# Altium schematic sheet serializer.SchDoc: SERIALIZER
size 431 x 279 mm; SheetNumber: 4; SheetTotal: 4; SheetRevision: 1.0
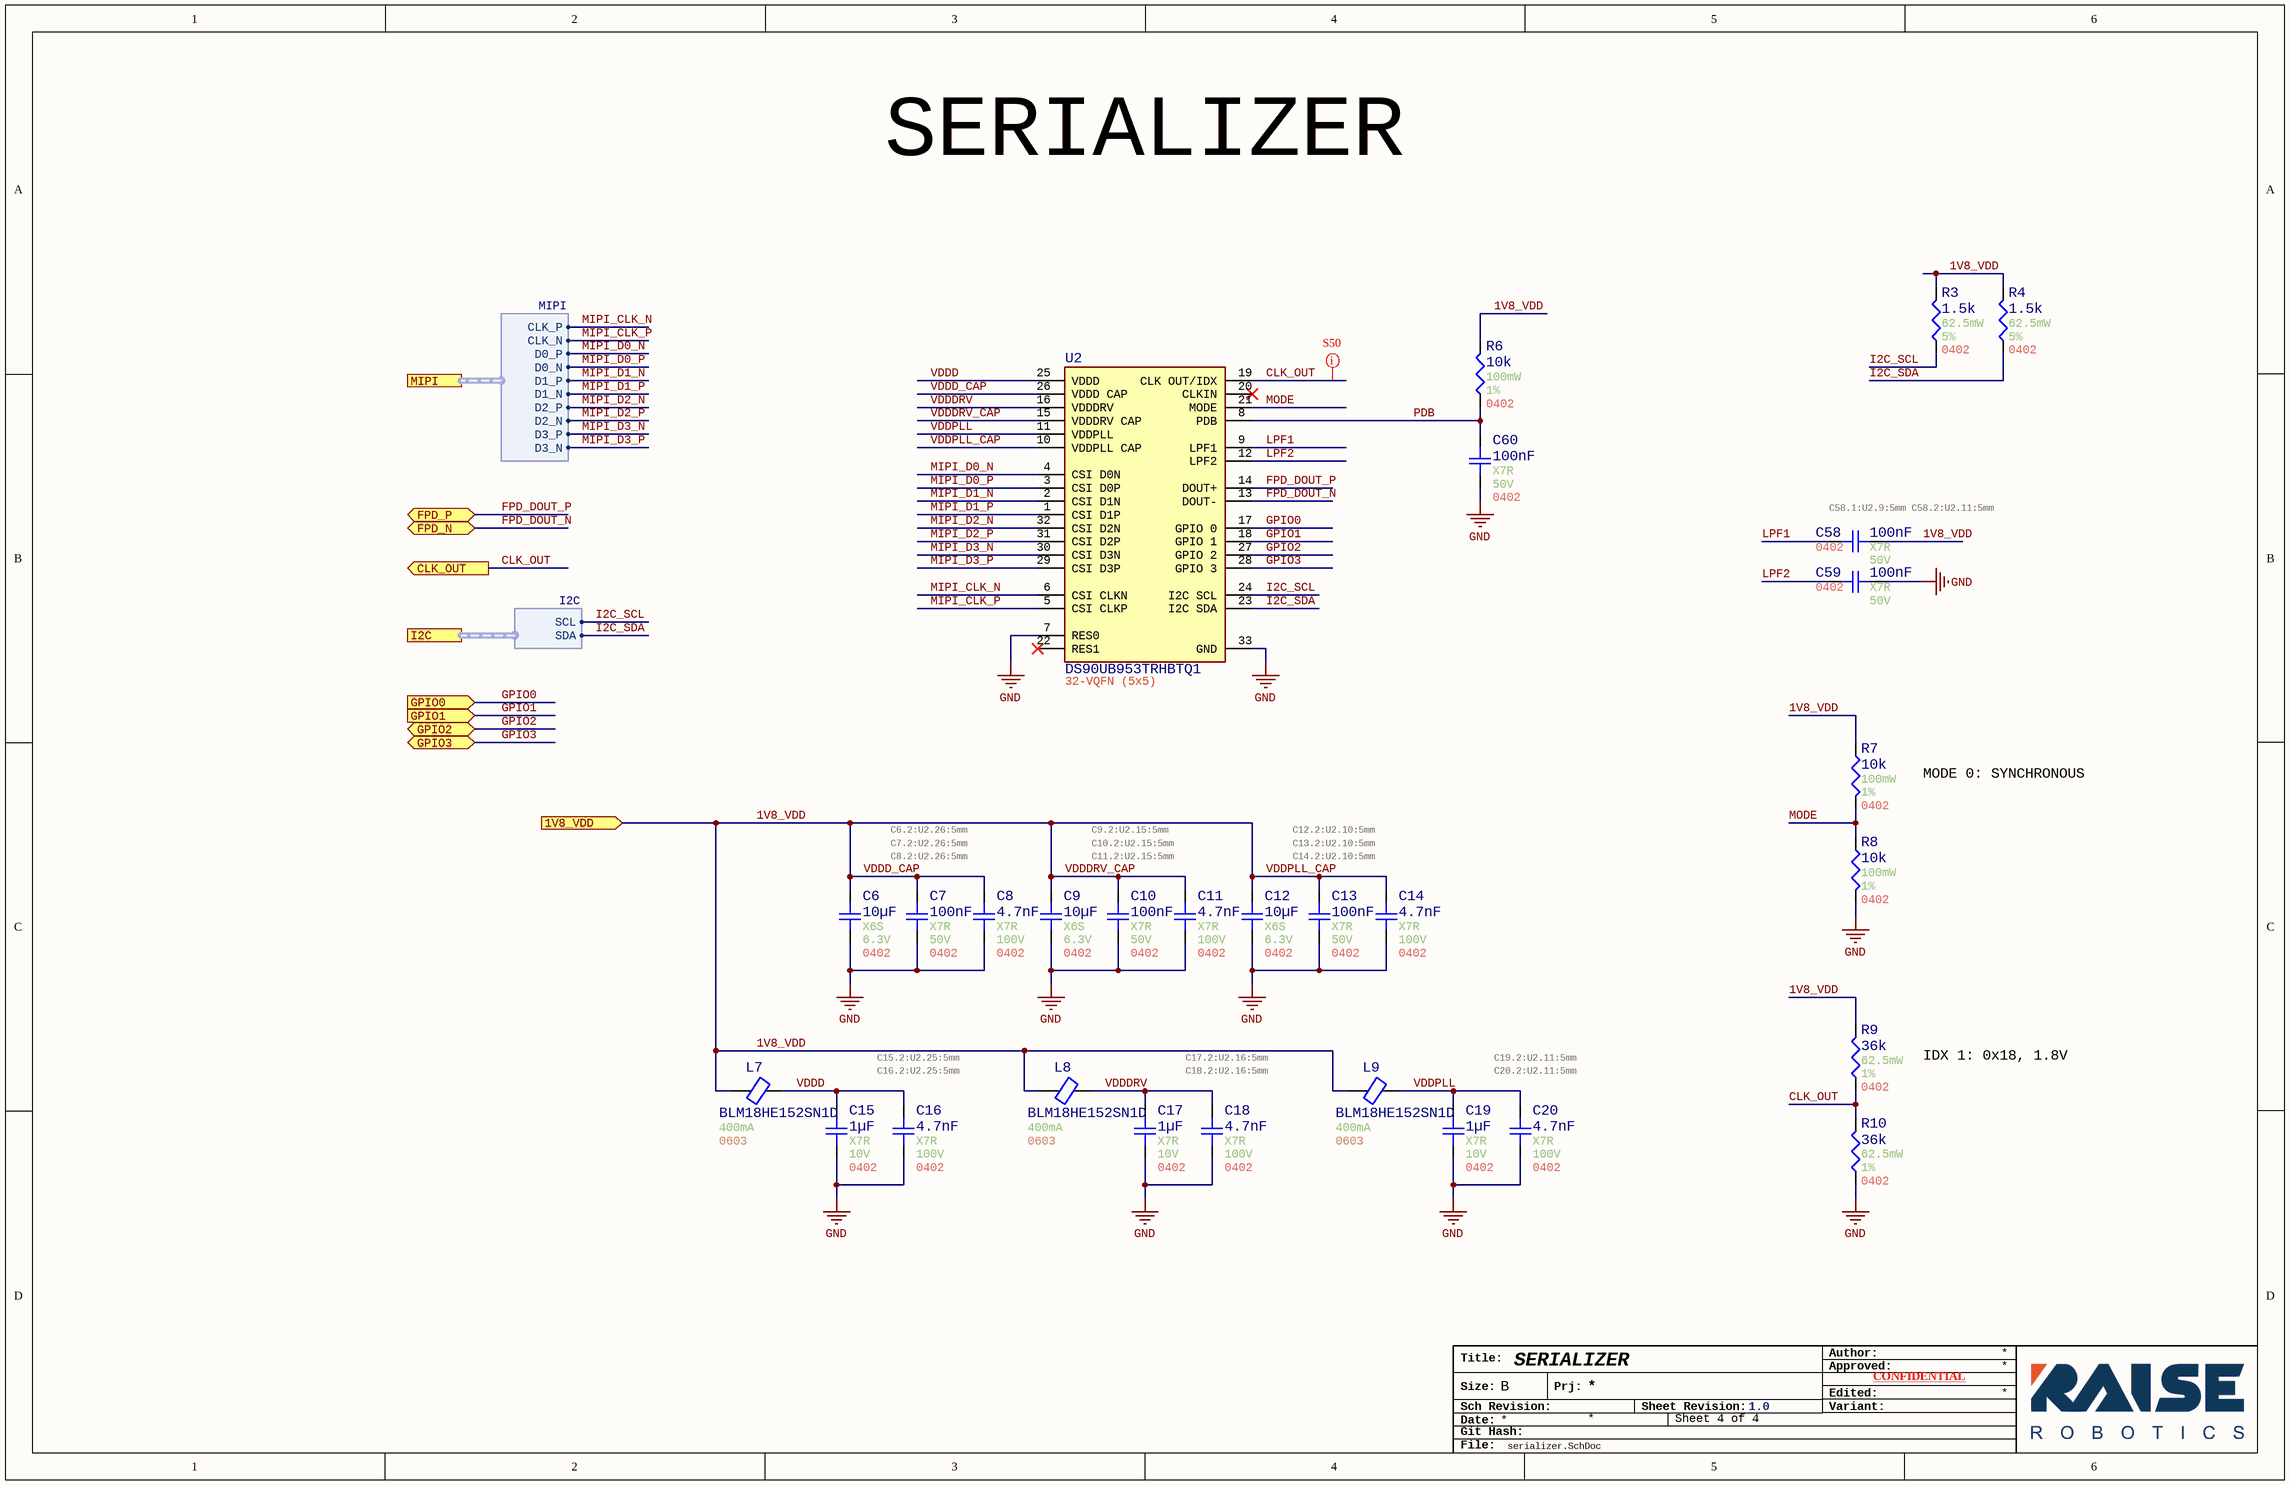
[diagram p0: serializer.SchDoc]

## Parts
C6  value 10µF  Temperature Coefficient: X6S  Voltage Rating: 6.3V  Case/Package: 0402  PlaceNear: C6.2:U2.26:5mm  [Generic 0402 capacitor]  (hidden comment: GRT155C80J106ME13J)
C7  value 100nF  Temperature Coefficient: X7R  Voltage Rating: 50V  Case/Package: 0402  PlaceNear: C7.2:U2.26:5mm  [Generic 0402 capacitor]  (hidden comment: GRT155R71H104KE01D)
C8  value 4.7nF  Temperature Coefficient: X7R  Voltage Rating: 100V  Case/Package: 0402  PlaceNear: C8.2:U2.26:5mm  [Generic 0402 capacitor]  (hidden comment: GCM155R72A472KA37D)
C9  value 10µF  Temperature Coefficient: X6S  Voltage Rating: 6.3V  Case/Package: 0402  PlaceNear: C9.2:U2.15:5mm  [Generic 0402 capacitor]  (hidden comment: GRT155C80J106ME13J)
C10  value 100nF  Temperature Coefficient: X7R  Voltage Rating: 50V  Case/Package: 0402  PlaceNear: C10.2:U2.15:5mm  [Generic 0402 capacitor]  (hidden comment: GRT155R71H104KE01D)
C11  value 4.7nF  Temperature Coefficient: X7R  Voltage Rating: 100V  Case/Package: 0402  PlaceNear: C11.2:U2.15:5mm  [Generic 0402 capacitor]  (hidden comment: GCM155R72A472KA37D)
C12  value 10µF  Temperature Coefficient: X6S  Voltage Rating: 6.3V  Case/Package: 0402  PlaceNear: C12.2:U2.10:5mm  [Generic 0402 capacitor]  (hidden comment: GRT155C80J106ME13J)
C13  value 100nF  Temperature Coefficient: X7R  Voltage Rating: 50V  Case/Package: 0402  PlaceNear: C13.2:U2.10:5mm  [Generic 0402 capacitor]  (hidden comment: GRT155R71H104KE01D)
C14  value 4.7nF  Temperature Coefficient: X7R  Voltage Rating: 100V  Case/Package: 0402  PlaceNear: C14.2:U2.10:5mm  [Generic 0402 capacitor]  (hidden comment: GCM155R72A472KA37D)
C15  value 1µF  Temperature Coefficient: X7R  Voltage Rating: 10V  Case/Package: 0402  PlaceNear: C15.2:U2.25:5mm  [Generic 0402 capacitor]  (hidden comment: MAASL105CD7105MFCA01)
C16  value 4.7nF  Temperature Coefficient: X7R  Voltage Rating: 100V  Case/Package: 0402  PlaceNear: C16.2:U2.25:5mm  [Generic 0402 capacitor]  (hidden comment: GCM155R72A472KA37D)
C17  value 1µF  Temperature Coefficient: X7R  Voltage Rating: 10V  Case/Package: 0402  PlaceNear: C17.2:U2.16:5mm  [Generic 0402 capacitor]  (hidden comment: MAASL105CD7105MFCA01)
C18  value 4.7nF  Temperature Coefficient: X7R  Voltage Rating: 100V  Case/Package: 0402  PlaceNear: C18.2:U2.16:5mm  [Generic 0402 capacitor]  (hidden comment: GCM155R72A472KA37D)
C19  value 1µF  Temperature Coefficient: X7R  Voltage Rating: 10V  Case/Package: 0402  PlaceNear: C19.2:U2.11:5mm  [Generic 0402 capacitor]  (hidden comment: MAASL105CD7105MFCA01)
C20  value 4.7nF  Temperature Coefficient: X7R  Voltage Rating: 100V  Case/Package: 0402  PlaceNear: C20.2:U2.11:5mm  [Generic 0402 capacitor]  (hidden comment: GCM155R72A472KA37D)
C58  value 100nF  Temperature Coefficient: X7R  Voltage Rating: 50V  Case/Package: 0402  PlaceNear: C58.1:U2.9:5mm / C58.2:U2.11:5mm  [Generic 0402 capacitor]  (hidden comment: GRT155R71H104KE01D)
C59  value 100nF  Temperature Coefficient: X7R  Voltage Rating: 50V  Case/Package: 0402  [Generic 0402 capacitor]  (hidden comment: GRT155R71H104KE01D)
C60  value 100nF  Temperature Coefficient: X7R  Voltage Rating: 50V  Case/Package: 0402  [Generic 0402 capacitor]  (hidden comment: GRT155R71H104KE01D)
L7  BLM18HE152SN1D  Current Rating: 400mA  Case/Package: 0603  [0603_1.6x0.8x0.8mm_IND]
L8  BLM18HE152SN1D  Current Rating: 400mA  Case/Package: 0603  [0603_1.6x0.8x0.8mm_IND]
L9  BLM18HE152SN1D  Current Rating: 400mA  Case/Package: 0603  [0603_1.6x0.8x0.8mm_IND]
R3  value 1.5k  Power: 62.5mW  Tolerance: 5%  Case/Package: 0402  [Generic 0402 Resistor]  (hidden comment: RMCF0402JT1K50)
R4  value 1.5k  Power: 62.5mW  Tolerance: 5%  Case/Package: 0402  [Generic 0402 Resistor]  (hidden comment: RMCF0402JT1K50)
R6  value 10k  Power: 100mW  Tolerance: 1%  Case/Package: 0402  [Generic 0402 Resistor]  (hidden comment: RNCP0402FTD10K0)
R7  value 10k  Power: 100mW  Tolerance: 1%  Case/Package: 0402  [Generic 0402 Resistor]  (hidden comment: RNCP0402FTD10K0)
R8  value 10k  Power: 100mW  Tolerance: 1%  Case/Package: 0402  [Generic 0402 Resistor]  (hidden comment: RNCP0402FTD10K0)
R9  value 36k  Power: 62.5mW  Tolerance: 1%  Case/Package: 0402  [Generic 0402 Resistor]  (hidden comment: AC0402FR-0736KL)
R10  value 36k  Power: 62.5mW  Tolerance: 1%  Case/Package: 0402  [Generic 0402 Resistor]  (hidden comment: AC0402FR-0736KL)
U2  DS90UB953TRHBTQ1  Case/Package: 32-VQFN (5x5)  [VQFN-32_5x5x1.0mm_P0.5mm]

## Ports
1V8_VDD (in), CLK_OUT (out), FPD_N (bidir), FPD_P (bidir), GPIO0 (in), GPIO1 (in), GPIO2 (bidir), GPIO3 (bidir), I2C (harness I2C), MIPI (harness MIPI)

## Harnesses
MIPI: CLK_P, CLK_N, D0_P, D0_N, D1_P, D1_N, D2_P, D2_N, D3_P, D3_N
I2C: SCL, SDA

## Nets
GND: C6.1 C7.1 C8.1 C9.1 C10.1 C11.1 C12.1 C13.1 C14.1 C15.1 C16.1 C17.1 C18.1 C19.1 C20.1 C59.2 C60.2 R8.2 R10.1 U2.7(RES0) U2.33(GND)
1V8_VDD: C6.2 C7.2 C8.2 C9.2 C10.2 C11.2 C12.2 C13.2 C14.2 C58.2 L7.1 L8.1 L9.1 R3.2 R4.2 R6.2 R7.1 R9.2 U2.10(VDDPLL_CAP) U2.15(VDDDRV_CAP) U2.26(VDDD_CAP) ; port 1V8_VDD  [also labelled VDDD_CAP, VDDDRV_CAP, VDDPLL_CAP]
CLK_OUT: R9.1 R10.2 U2.19(CLK_OUT/IDX) ; port CLK_OUT
FPD_DOUT_N: U2.13(DOUT-) ; port FPD_N
FPD_DOUT_P: U2.14(DOUT+) ; port FPD_P
GPIO0: U2.17(GPIO_0) ; port GPIO0
GPIO1: U2.18(GPIO_1) ; port GPIO1
GPIO2: U2.27(GPIO_2) ; port GPIO2
GPIO3: U2.28(GPIO_3) ; port GPIO3
I2C_SCL: R3.1 U2.24(I2C_SCL) ; port I2C.SCL
I2C_SDA: R4.1 U2.23(I2C_SDA) ; port I2C.SDA
LPF1: C58.1 U2.9(LPF1)
LPF2: C59.1 U2.12(LPF2)
MIPI_CLK_N: U2.6(CSI_CLKN) ; port MIPI.CLK_P
MIPI_CLK_P: U2.5(CSI_CLKP) ; port MIPI.CLK_N
MIPI_D0_N: U2.4(CSI_D0N) ; port MIPI.D0_P
MIPI_D0_P: U2.3(CSI_D0P) ; port MIPI.D0_N
MIPI_D1_N: U2.2(CSI_D1N) ; port MIPI.D1_P
MIPI_D1_P: U2.1(CSI_D1P) ; port MIPI.D1_N
MIPI_D2_N: U2.32(CSI_D2N) ; port MIPI.D2_P
MIPI_D2_P: U2.31(CSI_D2P) ; port MIPI.D2_N
MIPI_D3_N: U2.30(CSI_D3N) ; port MIPI.D3_P
MIPI_D3_P: U2.29(CSI_D3P) ; port MIPI.D3_N
MODE: R7.2 R8.1 U2.21(MODE)
PDB: C60.1 R6.1 U2.8(PDB)
VDDD: C15.2 C16.2 L7.2 U2.25(VDDD)
VDDDRV: C17.2 C18.2 L8.2 U2.16(VDDDRV)
VDDPLL: C19.2 C20.2 L9.2 U2.11(VDDPLL)

Not connected (* = marked no-connect by the designer): U2 20(CLKIN)* 22(RES1)*

## Layout directives
net class S50: CLK_OUT

## Notes on the sheet
- SERIALIZER
- MODE 0: SYNCHRONOUS
- IDX 1: 0x18, 1.8V
- Title:
- Author:
- Approved:
- Size:
- Date:
- Git Hash:
- Sch Revision:
- B
- Prj:
- Sheet Revision:
- Variant:
- Edited:
- CONFIDENTIAL
- File:

## Library data of the parts
C6 C9 C12 = CMP-001-00108-2: Multilayer Ceramic Capacitors MLCC - SMD/SMT 0402 10uF 6.3VDC 20% X6S AEC-Q200; AECQ: Yes; Mounting Technology: Surface Mount; RoHS Compliant: Yes; Pins: 2; Min Operating Temperature: -55°C; Capacitor Type: Ceramic; Tolerance: 20%; Max Operating Temperature: 105°C
C7 C10 C13 C58-C60 = CMP-001-00084-12: Ceramic Capacitor, Multilayer, Ceramic, 50V, 10% +Tol, 10% -Tol, X7R, 15% TC, 0.1uF, Surface Mount, 0402; Multilayer: Yes; Terminal Finish: Nickel; Capacitor Type: Ceramic; Package Shape: Rectangular; Reach SVHC Compliant: Yes; Max Operating Temperature: 125°C; RoHS Compliant: Yes; Termination: Wraparound; Packaging: Tape and Reel; AECQ: Yes; Pins: 2; Dielectric Material: Ceramic; Min Operating Temperature: -55°C; Tolerance: 10%; Mounting Technology: Surface Mount
C8 C11 C14 C16 C18 C20 = CMP-001-00110-2: Ceramic Capacitor, Multilayer, Ceramic, 100V, 10% +Tol, 10% -Tol, X7R, 15% TC, 0.0047uF, Surface Mount, 0402; AECQ: Yes; Min Operating Temperature: -55°C; Mounting Technology: SMD; Capacitor Type: Ceramic; Max Operating Temperature: 125°C; Tolerance: 10%; RoHS Compliant: Yes; Pins: 2
C15 C17 C19 = CMP-001-00104-2: Cap Cer 1UF 20V X7T 0402; AECQ: Yes; Capacitor Type: Ceramic; Tolerance: 20%; Min Operating Temperature: -55°C; Max Operating Temperature: 125°C; Pins: 2; RoHS Compliant: Yes; Mounting Technology: Surface Mount
L7-L9 = CMP-006-00026-1: Ferrite Beads Multi-Layer 1.5KOhm 25% 100MHz 500mA 500mOhm DCR 0603 T/R; Current - Saturation: 13.3A; AECQ: no; DCR: 20.5m; Shileded: Yes; Height: 800µm; Max Operating Temperature: 125°C; Pins: 2; Tolerance: 25%; Min Operating Temperature: -55°C
R3 R4 = CMP-009-00226-1: Res Thick Film 0402 1.5K Ohm 5% 0.063W ±100ppm/°C Molded SMD Paper T/R; AECQ: Yes; Pins: 2; Mounting Technology: Surface Mount; RoHS Compliant: Yes; Max Operating Temperature: 155°C; Min Operating Temperature: -55°C
R6-R8 = CMP-009-00242-1: Fixed Resistor, Thin Film, 0.1W, 10000ohm, 50V, 1% +/-Tol, 100ppm/Cel, Surface Mount, 0402; Manufacturer Part Number: Blank; AECQ: Yes; Pins: 2; Max Operating Temperature: 155°C; Voltage Rating: 50V; Mounting Technology: SMD; Min Operating Temperature: -55°C
R9 R10 = CMP-009-00198-3: Fixed Resistor, Metal Glaze/thick Film, 0.0625W, 36000ohm, 50V, 1% +/-Tol, 100ppm/Cel, Surface Mount, 0402; AECQ: Yes; Pins: 2; Mounting Technology: SMD; Min Operating Temperature: -55°C; Max Operating Temperature: 155°C
U2 = CMP-010-00047-1: 2 MP MIPI® CSI-2 FPD-Link III serializer for 2MP/60fps cameras & radar 32-VQFN -40 to 105; Nominal Supply Current: 370µA; Output Current: 6A; Max Supply Voltage: 3.6V; Sensor Type: Current shunt amp; Min Supply Voltage: 800mV; Nominal Supply Voltage: 5.7V; Pins: 32; Max Operating Temperature: 105°C; Min Operating Temperature: -40°C; Mounting Technology: SMD